# Altium project Stella PCB Design.PrjPcb
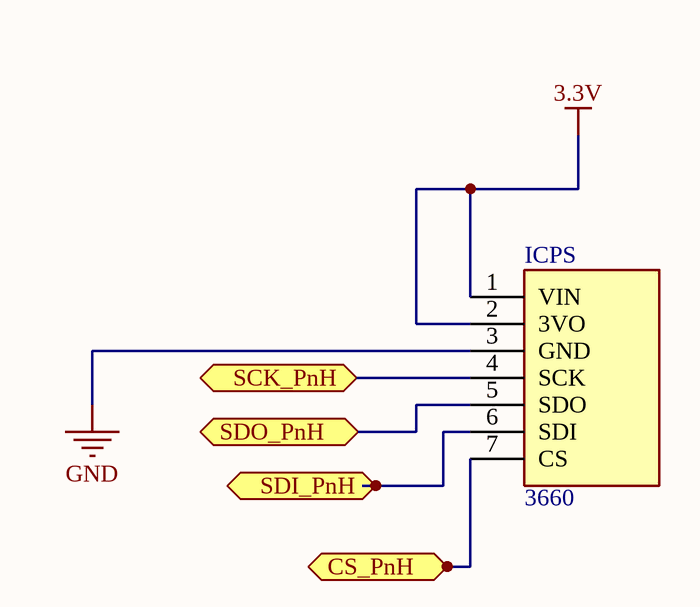
[diagram p0: Pressure Sensor.SchDoc]
CAGE_CODE: ?????; CONTRACT_NUMBER: <CONTRACT NO>; DOC_NO_ASSY_DWG: <ASSY DWG NO>; DOC_NO_BOM: <BOM DOC NO>; DOC_NO_FAB_DWG: <FAB DWG NO>; DOC_NO_SCH_DWG: <SCH DWG NO>; PCB_2_DEC_TOL: +/-.01; PCB_3_DEC_TOL: +/-.010; PCB_ANG_TOL: +/-1/2; PCB_ASSEMBLY_NO: <PCB ASSY NO>; PCB_CHECKER: - -----; PCB_CHECKER_APP_DATE: --/--/----; PCB_DESIGNER: - -----; PCB_DESIGNER_APP_DATE: --/--/----; PCB_DWG_NO: <PCB DWG NO>; PCB_ENGINEER: - -----; PCB_ENGINEER_APP_DATE: --/--/----; PCB_PART_NUMBER: <PCB PN>; PCB_REV: A; SCH_REV: A
7 sheets, 25 parts. Net scope: flat (ports and power ports of the same name join across sheets).
Board files: PCB1.PcbDoc, PCBDraft1Stella.PcbDoc
Sheets:
  Pressure Sensor.SchDoc
  Teensy Schematic.SchDoc
  Gyroscope.SchDoc
  Gas sensor.SchDoc
  Thermal camera_1.SchDoc
  Voltage Regulator.SchDoc
  Sheet1.SchDoc

## Sheet Pressure Sensor.SchDoc
size A; SheetNumber: 1; SheetTotal: 6

### Parts
ICPS  3660  [3660]

### Ports
CS_PnH (bidir), SCK_PnH (bidir), SDI_PnH (bidir), SDO_PnH (bidir)

### Nets
3.3V: ICPS.1(VIN) ICPS.2(3VO)
GND: ICPS.3(GND)
NetICPS_4: ICPS.4(SCK) ; port SCK_PnH
NetICPS_5: ICPS.5(SDO) ; port SDO_PnH
NetICPS_6: ICPS.6(SDI) ; port SDI_PnH
NetICPS_7: ICPS.7(CS) ; port CS_PnH

### Library data of the parts
ICPS = 3660: Integrated Circuit; Manufacturer_Name: Adafruit; Datasheet Link: https://cdn-learn.adafruit.com/downloads/pdf/adafruit-bme680-humidity-temperature-barometic-pressure-voc-gas.pdf; Height: 4mm; Manufacturer_Part_Number: 3660; Mouser Part Number: 485-3660; Mouser Price/Stock: https://www.mouser.co.uk/ProductDetail/Adafruit/3660?qs=W0yvOO0ixfFypXCClAyRMg%3D%3D; Arrow Part Number: 3660; Arrow Price/Stock: https://www.arrow.com/en/products/3660/adafruit-industries

## Sheet Teensy Schematic.SchDoc
size 431 x 279 mm; SheetNumber: 2; SheetTotal: 6; ENG_APP_DATE: --/--/--; DSN_APP_DATE: --/--/--; CHK_APP_DATE: --/--/--
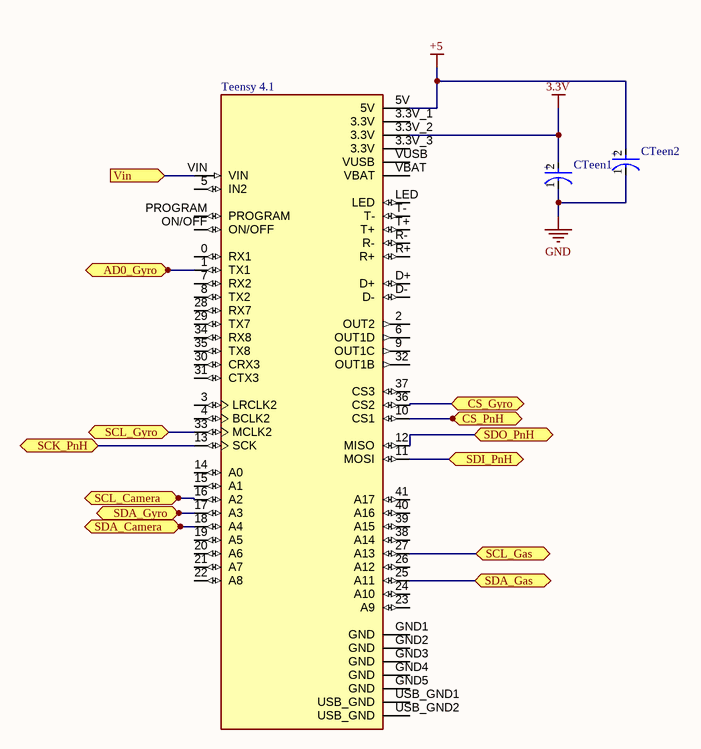
[diagram p1: Teensy Schematic.SchDoc]

### Parts
CTeen1  293D105X0016A2TE3  [FP-293DA-MFG]  (value not drawn)
CTeen2  293D105X0016A2TE3  [FP-293DA-MFG]  (value not drawn)
Teensy_4.1  Teensy 4.1  [MODULE_DEV-16771]  (value not drawn)

### Ports
AD0_Gyro (bidir), CS_Gyro (bidir), CS_PnH (bidir), SCK_PnH (bidir), SCL_Camera (bidir), SCL_Gas (bidir), SCL_Gyro (bidir), SDA_Camera (bidir), SDA_Gas (bidir), SDA_Gyro (bidir), SDI_PnH (bidir), SDO_PnH (bidir), Vin (in)

### Nets
3.3V: CTeen1.2(A) Teensy_4.1.3.3V_2(3.3V)
+5: CTeen2.2(A) Teensy_4.1.5V
GND: CTeen1.1(C) CTeen2.1(C)
NetICVR_3: Teensy_4.1.VIN ; port Vin
NetICGS_3: Teensy_4.1.25(A11) ; port SDA_Gas
NetICGS_6: Teensy_4.1.27(A13) ; port SCL_Gas
NetICGy_2: Teensy_4.1.33(MCLK2) ; port SCL_Gyro
NetICGy_3: Teensy_4.1.17(A3) ; port SDA_Gyro
NetICGy_4: Teensy_4.1.1(TX1) ; port AD0_Gyro
NetICGy_5: Teensy_4.1.36(CS2) ; port CS_Gyro
NetICPS_4: Teensy_4.1.13(SCK) ; port SCK_PnH
NetICPS_5: Teensy_4.1.12(MISO) ; port SDO_PnH
NetICPS_6: Teensy_4.1.11(MOSI) ; port SDI_PnH
NetICPS_7: Teensy_4.1.10(CS1) ; port CS_PnH
NetICTC_1: Teensy_4.1.18(A4) ; port SDA_Camera
NetICTC_4: Teensy_4.1.16(A2) ; port SCL_Camera

Not connected (* = marked no-connect by the designer): Teensy_4.1 0(RX1) 2(OUT2) 3(LRCLK2) 3.3V_1(3.3V) 3.3V_3(3.3V) 4(BCLK2) 5(IN2) 6(OUT1D) 7(RX2) 8(TX2) 9(OUT1C) 14(A0) 15(A1) 19(A5) 20(A6) 21(A7) 22(A8) 23(A9) 24(A10) 26(A12) 28(RX7) 29(TX7) 30(CRX3) 31(CTX3) 32(OUT1B) 34(RX8) 35(TX8) 37(CS3) 38(A14) 39(A15) 40(A16) 41(A17) D+ D- GND1(GND) GND2(GND) GND3(GND) GND4(GND) GND5(GND) LED ON/OFF PROGRAM R+ R- T+ T- USB_GND1(USB_GND) USB_GND2(USB_GND) VBAT VUSB

### Notes on the sheet
- DWG. NO.
- REV.
- SHT.
- THIS DOCUMENT AND THE DATA DISCLOSED HEREIN OR HEREWITH IS THE PROPERTY OF ALTIUM LIMITED AND MAY BE FREELY DISTRIBUTED IN WHOLE. NO RIGHTS ARE RESERVED OR EXPRESS OR IMPLIED WARANTEE GIVEN.
- REVISION
- DESCRIPTION
- DATE
- APPROVED
- ENG:
- APPROVALS
- PROJECT
- DSN:
- CHK:
- REFERENCE DOCUMENTS
- PROJECT REVISION:
- TITLE
- DOCUMENT REVISION:
- DESIGN ITEM:
- BOM:
- FAB DWG:
- PCB DWG:
- ASSY DWG:
- SCALE:
- SIZE
- B
- CAGE CODE
- FILE NAME
- DWG NO.
- SHEET
- OF
- REV
- (in symbol CMP-00030-40940187-1) +

### Library data of the parts
CTeen1 CTeen2 = CMP-00030-40940187-1: 293D105X0016A2TE3 Surface Mount Tantalum Capacitor, 1 uF, 16 V, ± 20%, -55 °C, 125 °C, 1206 [3216-18 Metric]; Ripple Current: 90mA; Capacitance: 1µF; Leakage Current: 500nA; Polarity: Polar; Voltage Rating (DC): 16V; Dissipation Factor: 4%; ESR (Equivalent Series Resistance): 9.3Ω; Case Code (Imperial): 1206; Case/Package: 1206; Schedule B: 8532210050, 8532210050; Height: 1.8mm; Mount: PCB, Surface Mount; Height - Seated (Max): 1.8034mm; Min Operating Temperature: -55°C; Max Operating Temperature: 125°C; Dielectric Material: Tantalum; Packaging: Tape and Reel; Radiation Hardening: No; Lead Free: Lead Free; Features: General Purpose; REACH SVHC: Unknown; Width: 1.6002mm; RoHS: Compliant; Tolerance: 20%; Termination: SMD/SMT; Length: 3.2mm; Depth: 1.6mm; Number of Pins: 2; Voltage Rating: 16V; NexarPartId: 40940187; Case Code (Metric): 3216
Teensy_4.1 = CMP-003-000000-1: RT1062 Teensy 4.1 series ARMÂ® CortexÂ®-M7 MPU Embedded Evaluation Board; MF: SparkFun Electronics; MP: DEV-16771; Package: None; Component Type: Standard; Pin Count: 65; Purchase-URL: https://pricing.snapeda.com/search/part/DEV-16771/?ref=eda; SnapEDA_Link: https://www.snapeda.com/parts/DEV-16771/SparkFun+Electronics/view-part/?ref=snap; Availability: In Stock; Source: DEV-16771.SchLib; Design Item ID: DEV-16771; Check_prices: https://www.snapeda.com/parts/DEV-16771/SparkFun+Electronics/view-part/?ref=eda; Value: *; Price: None

## Sheet Gyroscope.SchDoc
size A; SheetNumber: 3; SheetTotal: 6
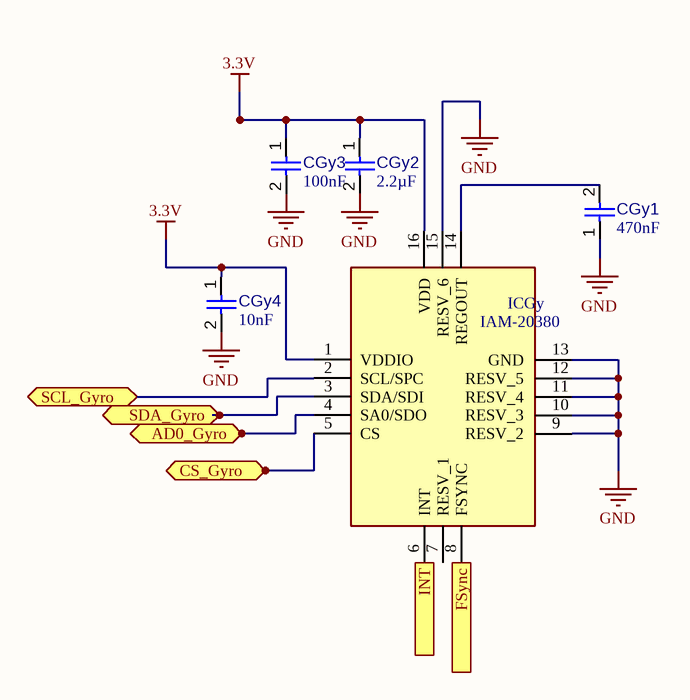
[diagram p2: Gyroscope.SchDoc]

### Parts
CGy1  value 470nF  [CAPC0402(1005)60_L]  (hidden comment: Capacitor 470nF +/-40% 10V 0402)
CGy2  value 2.2µF  [CAPC0402(1005)60_L]  (hidden comment: Capacitor 2,2µF +/-20% 10V 0402)
CGy3  value 100nF  [CAPC1005X56X25LL10T15]  (hidden comment: Capacitor 0.1 uF +/- 5% 16 V 0402)
CGy4  value 10nF  [CAPC0402(1005)60_L]  (hidden comment: Capacitor 10nF +/-20% 50V 0402)
ICGy  IAM-20380  [IAM20680HP]

### Ports
AD0_Gyro (bidir), CS_Gyro (bidir), FSync (out), INT (in), SCL_Gyro (bidir), SDA_Gyro (bidir)

### Nets
3.3V: CGy2.1 CGy3.1 CGy4.1 ICGy.1(VDDIO) ICGy.16(VDD)
GND: CGy1.1 CGy2.2 CGy3.2 CGy4.2 ICGy.9(RESV_2) ICGy.10(RESV_3) ICGy.11(RESV_4) ICGy.12(RESV_5) ICGy.13(GND) ICGy.15(RESV_6)
NetCGy1_2: CGy1.2 ICGy.14(REGOUT)
NetICGy_2: ICGy.2(SCL/SPC) ; port SCL_Gyro
NetICGy_3: ICGy.3(SDA/SDI) ; port SDA_Gyro
NetICGy_4: ICGy.4(SA0/SDO) ; port AD0_Gyro
NetICGy_5: ICGy.5(CS) ; port CS_Gyro
NetICGy_6: ICGy.6(INT) ; port INT
NetICGy_8: ICGy.8(FSYNC) ; port FSync

Not connected (* = marked no-connect by the designer): ICGy 7(RESV_1)

### Library data of the parts
CGy1 = CMP-001-00060-4: Chip Capacitor, 470nF +/-40%, 10V, 0402, Thickness 0.6 mm; Tolerance: 20%; Max Operating Temperature: 85°C; Case/Package: 0402; Voltage Rating: 10V; Min Operating Temperature: -55°C; Mounting Technology: SMT; Pins: 2
CGy2 = CMP-001-00056-4: Chip Capacitor, 2,2µF +/-20%, 10V, 0402, Thickness 0.6 mm; Tolerance: 10%; Mounting Technology: SMT; Max Operating Temperature: 85°C; Case/Package: 0402; Pins: 2; Min Operating Temperature: -55°C; Voltage Rating: 10V
CGy3 = CMP-001-00001-6: Chip Capacitor, 0.1 uF, +/- 5%, 16 V, 0402 (1005 Metric); Capacitor Type: Ceramic; Voltage Rating: 16V; Max Operating Temperature: 125°C; Min Operating Temperature: -55°C; Case/Package: 0402; Mounting Technology: SM; Pins: 2; Tolerance: 5%; RoHS Compliant: True
CGy4 = CMP-001-00069-3: Chip Capacitor, 10nF +/-20%, 50V, 0402, Thickness 0.6 mm; Tolerance: 5%; Max Operating Temperature: 85°C; Pins: 2; Case/Package: 0402; Voltage Rating: 50V; Min Operating Temperature: -55°C; Mounting Technology: SMT
ICGy = IAM-20380: Integrated Circuit; Manufacturer_Name: TDK; Datasheet Link: https://3cfeqx1hf82y3xcoull08ihx-wpengine.netdna-ssl.com/wp-content/uploads/2017/11/DS-000195-IAM-20380_v1.0-Typ.pdf; Height: 0.8mm; Manufacturer_Part_Number: IAM-20380; Mouser Part Number: 410-IAM-20380; Mouser Price/Stock: https://www.mouser.co.uk/ProductDetail/TDK-InvenSense/IAM-20380?qs=PzGy0jfpSMtUqQt0Uo%252BcYw%3D%3D; Arrow Part Number: IAM-20380; Arrow Price/Stock: https://www.arrow.com/en/products/iam-20380/invensense

## Sheet Gas sensor.SchDoc
size A4; SheetNumber: 4; SheetTotal: 6
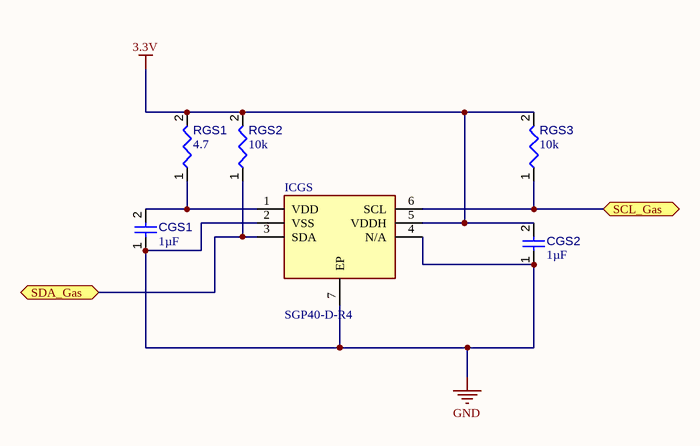
[diagram p3: Gas sensor.SchDoc]

### Parts
CGS1  value 1µF  [CAPC1005X55X25ML5T10]  (hidden comment: Capacitor 1 uF +/- 10% 6.3 V 1005)
CGS2  value 1µF  [CAPC1005X55X25ML5T10]  (hidden comment: Capacitor 1 uF +/- 10% 6.3 V 1005)
ICGS  SGP40-D-R4  [SON80P244X244X95-7N]
RGS1  value 4.7  [RESC0805(2012)_L]  (hidden comment: Resistor 4R7  +/-5 % 0805 125 mW)
RGS2  value 10k  [RESC0402(1005)_L]  (hidden comment: Resistor 10K  +/-1 % 0402 63 mW)
RGS3  value 10k  [RESC0402(1005)_L]  (hidden comment: Resistor 10K  +/-1 % 0402 63 mW)

### Ports
SCL_Gas (bidir), SDA_Gas (bidir)

### Nets
3.3V: CGS2.2 ICGS.5(VDDH) RGS1.2 RGS2.2 RGS3.2
GND: CGS1.1 CGS2.1 ICGS.2(VSS) ICGS.4(N/A) ICGS.7(EP)
NetCGS1_2: CGS1.2 ICGS.1(VDD) RGS1.1
NetICGS_3: ICGS.3(SDA) RGS2.1 ; port SDA_Gas
NetICGS_6: ICGS.6(SCL) RGS3.1 ; port SCL_Gas

### Library data of the parts
CGS1 CGS2 = CMP-001-00009-6: Chip Capacitor, 1 uF, +/- 10%, 6.3 V, 1005 (0402 Metric); Voltage Rating: 6.3V; Capacitor Type: Ceramic; Min Operating Temperature: -55°C; Case/Package: 0402; Tolerance: 10%; Mounting Technology: SM; Max Operating Temperature: 85°C; RoHS Compliant: True; Pins: 2
ICGS = SGP40-D-R4: Integrated Circuit; Manufacturer_Name: Sensirion; Datasheet Link: https://www.mouser.com/datasheet/2/682/Sensirion_Gas_Sensors_SGP40_Datasheet-1888696.pdf; Height: 0.95mm; Manufacturer_Part_Number: SGP40-D-R4; Mouser Part Number: 403-SGP40-D-R4; Mouser Price/Stock: https://www.mouser.co.uk/ProductDetail/Sensirion/SGP40-D-R4?qs=yqaQSyyJnNgaRqiZfsbS1Q%3D%3D; Arrow Part Number: SGP40-D-R4; Arrow Price/Stock: https://www.arrow.com/en/products/sgp40-d-r4/sensirion-ag?region=nac
RGS1 = CMP-009-00174-3: Chip Resistor, 4,7 Ohms, +/-5 %, 125 mW, -55 to 155 degC, 0805; Tolerance: 5%; Power: 125mW; Max Operating Temperature: 155°C; Case/Package: 0805; Min Operating Temperature: -55°C; Pins: 2
RGS2 RGS3 = CMP-009-00149-3: Chip Resistor, 10 kOhms, +/-1 %, 63 mW, -55 to 125 degC, 0402; Power: 63mW; Tolerance: 1%; Min Operating Temperature: -55°C; Case/Package: 0402; Max Operating Temperature: 155°C; Pins: 2

## Sheet Thermal camera_1.SchDoc
size A4; SheetNumber: 5; SheetTotal: 6
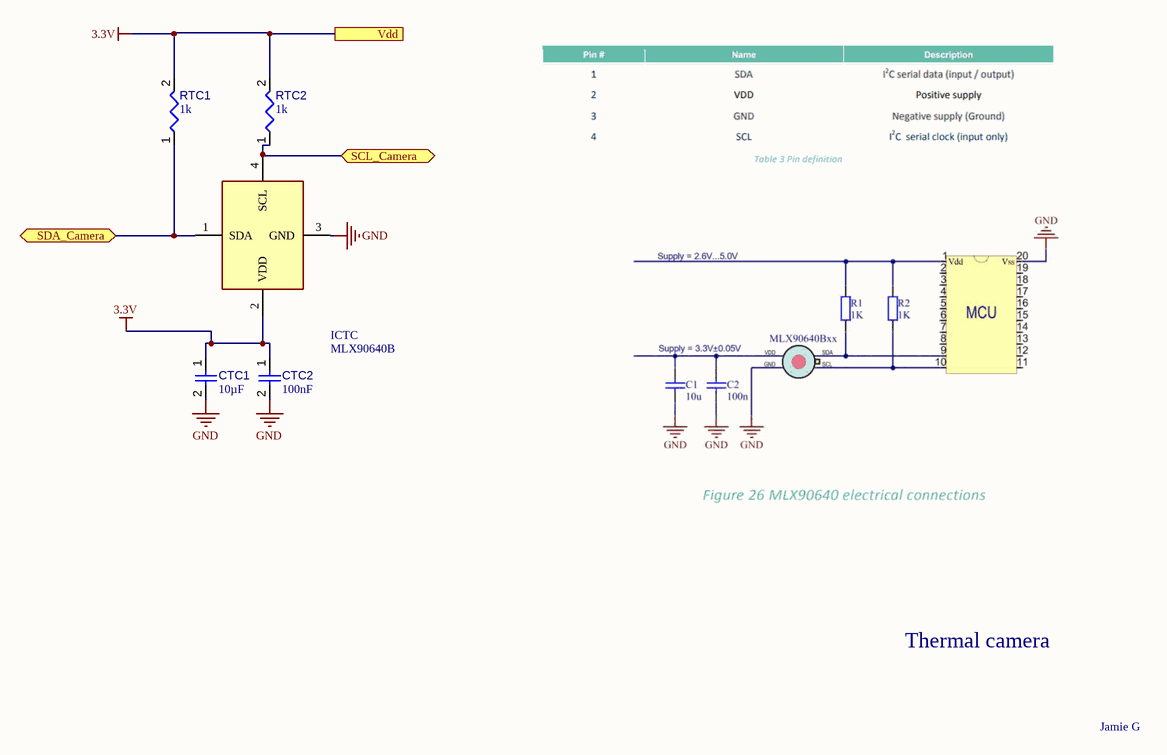
[diagram p4: Thermal camera_1.SchDoc]

### Parts
CTC1  value 10µF  [CAPC0603(1608)100_L]  (hidden comment: Capacitor 10µF +/-20% 10V 0603)
CTC2  value 100nF  [CAPC0402(1005)60_L]  (hidden comment: Capacitor 100nF +/-20% 10V 0402)
ICTC  MLX90640B  [MLX90640ESFBAA000TU]
RTC1  value 1k  [RESC0402(1005)_L]  (hidden comment: Resistor 1K +/-5 % 0402 63 mW)
RTC2  value 1k  [RESC0402(1005)_L]  (hidden comment: Resistor 1K +/-5 % 0402 63 mW)

### Ports
SCL_Camera (bidir), SDA_Camera (bidir), Vdd

### Nets
3.3V: CTC1.1 CTC2.1 ICTC.2(VDD) RTC1.2 RTC2.2 ; port Vdd
GND: CTC1.2 CTC2.2 ICTC.3(GND)
NetICTC_1: ICTC.1(SDA) RTC1.1 ; port SDA_Camera
NetICTC_4: ICTC.4(SCL) RTC2.1 ; port SCL_Camera

### Notes on the sheet
- Thermal camera
- Jamie G

### Library data of the parts
CTC1 = CMP-001-00075-4: Chip Capacitor, 10µF +/-20%, 10V, 0603, Thickness 1 mm; Tolerance: 10%; Voltage Rating: 10V; Max Operating Temperature: 85°C; Pins: 2; Case/Package: 0603; Mounting Technology: SMT; Min Operating Temperature: -55°C
CTC2 = CMP-001-00061-3: Chip Capacitor, 100nF +/-20%, 10V, 0402, Thickness 0.6 mm; Tolerance: 20%; Mounting Technology: SMT; Voltage Rating: 10V; Max Operating Temperature: 85°C; Pins: 2; Case/Package: 0402; Min Operating Temperature: -55°C
ICTC = MLX90640ESF-BAA-000-SP: Integrated Circuit; Manufacturer_Name: Melexis; Datasheet Link: https://componentsearchengine.com/Datasheets/1/MLX90640ESF-BAA-000-SP.pdf; Height: 6mm; Manufacturer_Part_Number: MLX90640ESF-BAA-000-SP; Mouser Part Number: 482-MLX90640ESFBAASP; Mouser Price/Stock: https://www.mouser.co.uk/ProductDetail/Melexis/MLX90640ESF-BAA-000-SP?qs=y6ZabgHbY%252Bz1Luyoz5kAtA%3D%3D; Arrow Part Number: MLX90640ESF-BAA-000-SP; Arrow Price/Stock: https://www.arrow.com/en/products/mlx90640esf-baa-000-sp/melexis?region=nac
RTC1 RTC2 = CMP-009-00157-3: Chip Resistor, 1 kOhms, +/-5 %, 63 mW, -55 to 155 degC, 0402; Tolerance: 5%; Power: 63mW; Case/Package: 0402; Pins: 2; Min Operating Temperature: -55°C; Max Operating Temperature: 155°C

## Sheet Voltage Regulator.SchDoc
size A; SheetNumber: 6; SheetTotal: 6
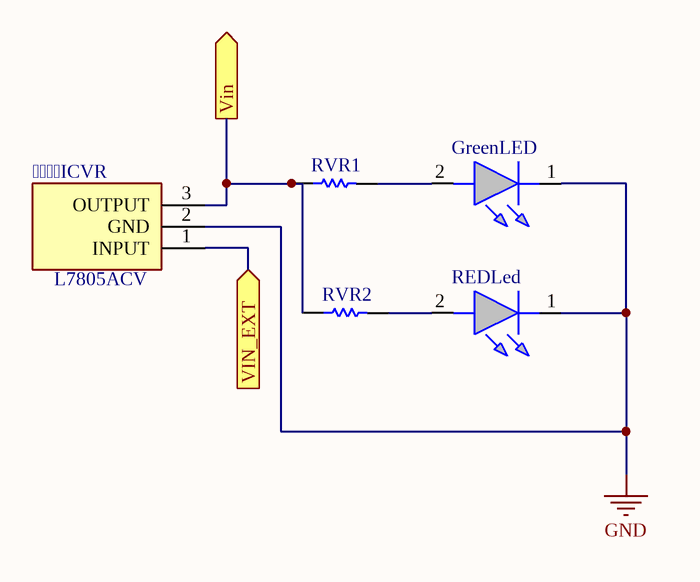
[diagram p5: Voltage Regulator.SchDoc]

### Parts
ICVR  L7805ACV  [TO255P460X1020X2008-3P]
GreenLED  ASCKCG00-NW5X5020302  [ASCKCG00NW5X5020302]  (value not drawn)
REDLed  ASCKCR00-BU5V5020402  [ASCKCR00BU5V5020402]  (value not drawn)
RVR1  CRCW0603110RFKEA  [RESC1609X50X30NL10T20]  (value not drawn)
RVR2  CRCW0603110RFKEA  [RESC1609X50X30NL10T20]  (value not drawn)

### Ports
Vin (out), VIN_EXT (in)

### Nets
GND: ICVR.2(GND) GreenLED.1(K) REDLed.1(K)
NetICVR_1: ICVR.1(INPUT) ; port VIN_EXT
NetICVR_3: ICVR.3(OUTPUT) RVR1.1 RVR2.1 ; port Vin
NetGreenLED_2: GreenLED.2(A) RVR1.2
NetREDLed_2: REDLed.2(A) RVR2.2

### Library data of the parts
ICVR = CMP-028-000000-1: Linear voltage regulator,L7805ACV 5V 1A STMicroelectronics L7805ACV, Single Linear Voltage Regulator, 1A 5 V, 2%, 3-Pin TO-220; Geometry.Height: 4.6mm; Manufacturer_Name: STMicroelectronics; Mouser Part Number: 511-L7805ACV; Mouser Price/Stock: https://www.mouser.co.uk/ProductDetail/STMicroelectronics/L7805ACV?qs=xv3lWMc77RdYd2PeLwOwYw%3D%3D; Manufacturer_Part_Number: L7805ACV; Design Item ID: L7805ACV; Datasheet Link: http://www.st.com/web/en/resource/technical/document/datasheet/CD00000444.pdf; Source: L7805ACV.SchLib
GreenLED = CMP-004-00031-1: Green 524nm LED Indication - Discrete 3.3V 0603 (1608 Metric); Manufacturer_Name: Avago Technologies; Geometry.Height: 0.75mm; Mouser Price/Stock: https://www.mouser.co.uk/ProductDetail/Broadcom-Avago/ASCKCG00-NW5X5020302?qs=OcgtsXO%252B3gsRJ%252BJUmBwdbA%3D%3D; Manufacturer_Part_Number: ASCKCG00-NW5X5020302; Source: ASCKCG00-NW5X5020302.SchLib; Design Item ID: ASCKCG00-NW5X5020302; Datasheet Link: https://docs.broadcom.com/doc/ASCKCx00-xxxxx0x0x02-DS; Mouser Part Number: 630-ASCKCG00NW5X5020
REDLed = CMP-004-00032-1: Red 622nm LED Indication - Discrete 2.1V 0603 (1608 Metric); Manufacturer_Name: Avago Technologies; Geometry.Height: 0.75mm; Mouser Part Number: 630-ASCKCR00BU5V5020; Mouser Price/Stock: https://www.mouser.co.uk/ProductDetail/Broadcom-Avago/ASCKCR00-BU5V5020402?qs=OcgtsXO%252B3gu355%2FiA8jcWA%3D%3D; Source: ASCKCR00-BU5V5020402.SchLib; Datasheet Link: https://docs.broadcom.com/doc/ASCKCx00-xxxxx0x0x02-DS; Manufacturer_Part_Number: ASCKCR00-BU5V5020402; Design Item ID: ASCKCR00-BU5V5020402
RVR1 RVR2 = CMP-2000-03854-1: Manufacturer: Vishay Dale; Part Number: CRCW0603110RFKEA

## Sheet Sheet1.SchDoc
size A; SheetNumber: 7; SheetTotal: 7

## Nets that join several sheets
3.3V: Pressure Sensor (ICPS.1 ICPS.2), Teensy Schematic (CTeen1.2 Teensy_4.1.3.3V_2), Gyroscope (5 pins), Gas sensor (5 pins), Thermal camera_1 (5 pins)
GND: Pressure Sensor (ICPS.3), Teensy Schematic (CTeen1.1 CTeen2.1), Gyroscope (10 pins), Gas sensor (5 pins), Thermal camera_1 (CTC1.2 CTC2.2 ICTC.3), Voltage Regulator (ICVR.2 GreenLED.1 REDLed.1)
NetICVR_3: Teensy Schematic (Teensy_4.1.VIN), Voltage Regulator (ICVR.3 RVR1.1 RVR2.1)
NetICGS_3: Teensy Schematic (Teensy_4.1.25), Gas sensor (ICGS.3 RGS2.1)
NetICGS_6: Teensy Schematic (Teensy_4.1.27), Gas sensor (ICGS.6 RGS3.1)
NetICGy_2: Teensy Schematic (Teensy_4.1.33), Gyroscope (ICGy.2)
NetICGy_3: Teensy Schematic (Teensy_4.1.17), Gyroscope (ICGy.3)
NetICGy_4: Teensy Schematic (Teensy_4.1.1), Gyroscope (ICGy.4)
NetICGy_5: Teensy Schematic (Teensy_4.1.36), Gyroscope (ICGy.5)
NetICPS_4: Pressure Sensor (ICPS.4), Teensy Schematic (Teensy_4.1.13)
NetICPS_5: Pressure Sensor (ICPS.5), Teensy Schematic (Teensy_4.1.12)
NetICPS_6: Pressure Sensor (ICPS.6), Teensy Schematic (Teensy_4.1.11)
NetICPS_7: Pressure Sensor (ICPS.7), Teensy Schematic (Teensy_4.1.10)
NetICTC_1: Teensy Schematic (Teensy_4.1.18), Thermal camera_1 (ICTC.1 RTC1.1)
NetICTC_4: Teensy Schematic (Teensy_4.1.16), Thermal camera_1 (ICTC.4 RTC2.1)